# Altium schematic sheet 5V_to_15V.SchDoc
size A4; CompanyName: Technische Hochschule Nürnberg Georg Simon Ohm; Address1: Fürther Straße 250; Address2: 90429 Nürnberg; Address3: GERMANY; DocumentNumber: 4; SheetNumber: 4; SheetTotal: 16; CompanyName2: Institut ELSYS
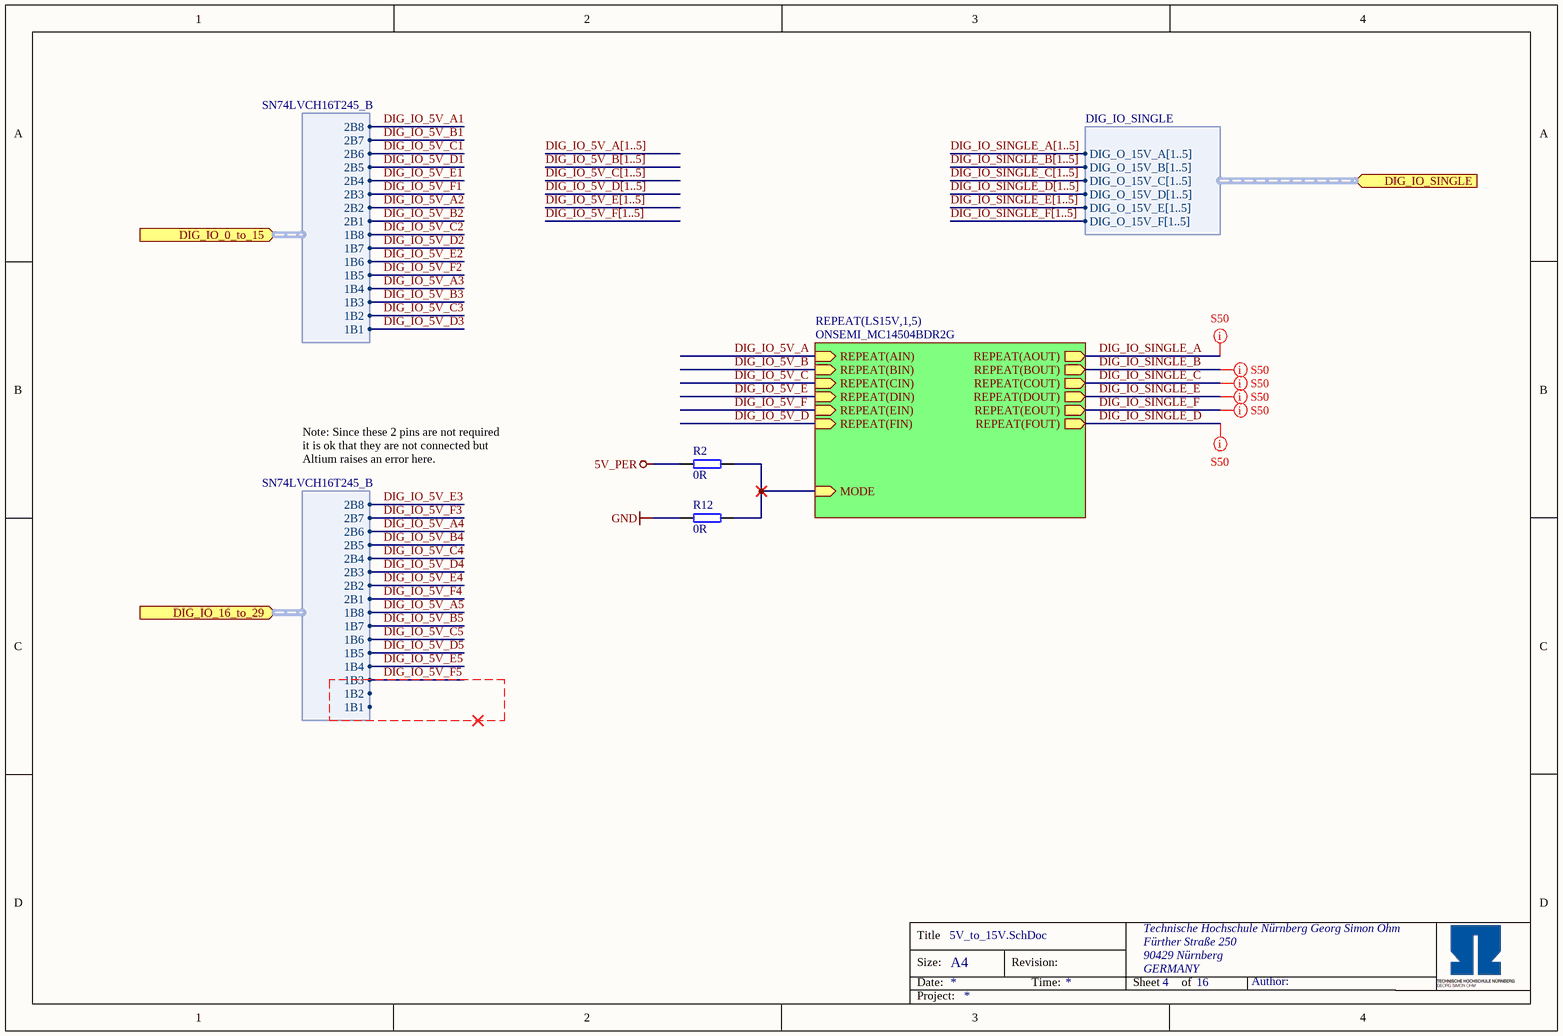
[diagram p0: 5V_to_15V.SchDoc]

## Parts
R2  0R  [RES 0603_1608]
R12  0R  [RES 0603_1608]

## Sub-sheets
REPEAT(LS15V,1,5) = ONSEMI_MC14504BDR2G: REPEAT(FOUT) (out), REPEAT(EOUT) (out), REPEAT(DIN) (in), MODE (in), REPEAT(CIN) (in), REPEAT(BOUT) (out), REPEAT(FIN) (in), REPEAT(EIN) (in), REPEAT(BIN) (in), REPEAT(COUT) (out), REPEAT(AIN) (in), REPEAT(AOUT) (out), REPEAT(DOUT) (out)

## Ports
DIG_IO_0_to_15 (in, harness SN74LVCH16T245_B), DIG_IO_16_to_29 (in, harness SN74LVCH16T245_B), DIG_IO_SINGLE (in, harness DIG_IO_SINGLE)

## Harnesses
SN74LVCH16T245_B: 1B1, 1B2, 1B3, 1B4, 1B5, 1B6, 1B7, 1B8, 2B1, 2B2, 2B3, 2B4, 2B5, 2B6, 2B7, 2B8
DIG_IO_SINGLE: DIG_O_15V_A[1..5], DIG_O_15V_B[1..5], DIG_O_15V_C[1..5], DIG_O_15V_D[1..5], DIG_O_15V_E[1..5], DIG_O_15V_F[1..5]

## Nets
5V_PER: R2.1
GND: R12.1
DIG_IO_5V_A: sheet REPEAT(LS15V,1,5)/REPEAT(AIN)
DIG_IO_5V_A1: port DIG_IO_0_to_15.2B8
DIG_IO_5V_A2: port DIG_IO_0_to_15.2B2
DIG_IO_5V_A3: port DIG_IO_0_to_15.1B4
DIG_IO_5V_A4: port DIG_IO_16_to_29.2B6
DIG_IO_5V_A5: port DIG_IO_16_to_29.1B8
DIG_IO_5V_B: sheet REPEAT(LS15V,1,5)/REPEAT(BIN)
DIG_IO_5V_B1: port DIG_IO_0_to_15.2B7
DIG_IO_5V_B2: port DIG_IO_0_to_15.2B1
DIG_IO_5V_B3: port DIG_IO_0_to_15.1B3
DIG_IO_5V_B4: port DIG_IO_16_to_29.2B5
DIG_IO_5V_B5: port DIG_IO_16_to_29.1B7
DIG_IO_5V_C: sheet REPEAT(LS15V,1,5)/REPEAT(CIN)
DIG_IO_5V_C1: port DIG_IO_0_to_15.2B6
DIG_IO_5V_C2: port DIG_IO_0_to_15.1B8
DIG_IO_5V_C3: port DIG_IO_0_to_15.1B2
DIG_IO_5V_C4: port DIG_IO_16_to_29.2B4
DIG_IO_5V_C5: port DIG_IO_16_to_29.1B6
DIG_IO_5V_D: sheet REPEAT(LS15V,1,5)/REPEAT(FIN)
DIG_IO_5V_D1: port DIG_IO_0_to_15.2B5
DIG_IO_5V_D2: port DIG_IO_0_to_15.1B7
DIG_IO_5V_D3: port DIG_IO_0_to_15.1B1
DIG_IO_5V_D4: port DIG_IO_16_to_29.2B3
DIG_IO_5V_D5: port DIG_IO_16_to_29.1B5
DIG_IO_5V_E: sheet REPEAT(LS15V,1,5)/REPEAT(DIN)
DIG_IO_5V_E1: port DIG_IO_0_to_15.2B4
DIG_IO_5V_E2: port DIG_IO_0_to_15.1B6
DIG_IO_5V_E3: port DIG_IO_16_to_29.2B8
DIG_IO_5V_E4: port DIG_IO_16_to_29.2B2
DIG_IO_5V_E5: port DIG_IO_16_to_29.1B4
DIG_IO_5V_F: sheet REPEAT(LS15V,1,5)/REPEAT(EIN)
DIG_IO_5V_F1: port DIG_IO_0_to_15.2B3
DIG_IO_5V_F2: port DIG_IO_0_to_15.1B5
DIG_IO_5V_F3: port DIG_IO_16_to_29.2B7
DIG_IO_5V_F4: port DIG_IO_16_to_29.2B1
DIG_IO_5V_F5: port DIG_IO_16_to_29.1B3
DIG_IO_SINGLE_A: sheet REPEAT(LS15V,1,5)/REPEAT(AOUT)
DIG_IO_SINGLE_B: sheet REPEAT(LS15V,1,5)/REPEAT(BOUT)
DIG_IO_SINGLE_C: sheet REPEAT(LS15V,1,5)/REPEAT(COUT)
DIG_IO_SINGLE_D: sheet REPEAT(LS15V,1,5)/REPEAT(FOUT)
DIG_IO_SINGLE_E: sheet REPEAT(LS15V,1,5)/REPEAT(DOUT)
DIG_IO_SINGLE_F: sheet REPEAT(LS15V,1,5)/REPEAT(EOUT)
NetR2_2: R2.2 R12.2 ; sheet REPEAT(LS15V,1,5)/MODE

## Buses and harness runs
bus DIG_IO_5V_A[1..5]
bus DIG_IO_5V_B[1..5]
bus DIG_IO_5V_C[1..5]
bus DIG_IO_5V_D[1..5]
bus DIG_IO_5V_E[1..5]
bus DIG_IO_5V_F[1..5]
bus DIG_IO_SINGLE_A[1..5]
bus DIG_IO_SINGLE_B[1..5]
bus DIG_IO_SINGLE_C[1..5]
bus DIG_IO_SINGLE_D[1..5]
bus DIG_IO_SINGLE_E[1..5]
bus DIG_IO_SINGLE_F[1..5]

## Layout directives
net class S50: DIG_IO_SINGLE_A, DIG_IO_SINGLE_B, DIG_IO_SINGLE_C, DIG_IO_SINGLE_D, DIG_IO_SINGLE_E, DIG_IO_SINGLE_F

## Notes on the sheet
- Note: Since these 2 pins are not required it is ok that they are not connected but Altium raises an error here.
- Title
- Size:
- Date:
- A4
- Revision:
- Time:
- Sheet
- of
- Author:
- Project:

## Library data of the parts
R2 R12 = RC0603JR-070RL: SMD resistor E24 series; Manufacturer: YAGEO; Tolerance: 5%; Created from: MGremer; Manufacturer Part Number: RC0603JR-070RL; PartID: 1; Created On: 14.12.2020 16:17:14; ComponentLink1Description: Datasheet; ComponentLink1URL: https://www.mouser.de/datasheet/2/447/PYu-RC_Group_51_RoHS_L_10-1664068.pdf; Component Type: SMD resistor; Device Package: 0603; Last Updated: 04.03.2021 09:09:42; Mounting Type: SMD; Supplier 1: Mouser; Supplier Part Number 1: 603-RC0603JR-070RL; Type: Resistor; Value: 0R; Live Cycle Status: 1; Stock number: Labor SMD Container; LCSC Part Number: C21189; Supplier 2: LCSC; Supplier Part Number 2: C21189